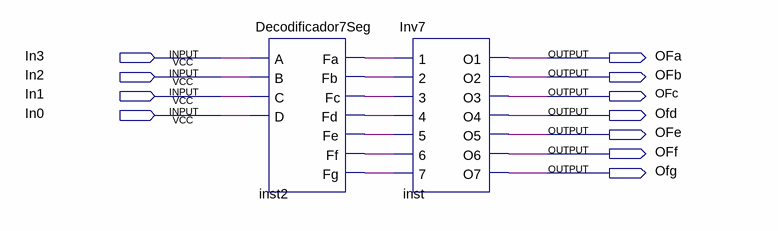
[diagram p0: schematic sheet]
// Quartus schematic Dec7Inv.bdf as structural Verilog: 2 symbols, 11 pins
module Dec7Inv (
  input  In3,
  input  In2,
  input  In1,
  input  In0,
  output OFa,
  output OFb,
  output OFc,
  output Ofd,
  output OFe,
  output OFf,
  output Ofg
);

  wire inst2_fa, inst2_fb, inst2_fc, inst2_fd, inst2_fe, inst2_ff, inst2_fg;

  Decodificador7Seg inst2 (
    .A(In3), .B(In2), .C(In1), .D(In0), .Fa(inst2_fa), .Fb(inst2_fb), .Fc(inst2_fc), .Fd(inst2_fd),
    .Fe(inst2_fe), .Ff(inst2_ff), .Fg(inst2_fg));
  Inv7 inst (
    .\1 (inst2_fa), .\2 (inst2_fb), .\3 (inst2_fc), .\4 (inst2_fd), .\5 (inst2_fe), .\6 (inst2_ff),
    .\7 (inst2_fg), .O1(OFa), .O2(OFb), .O3(OFc), .O4(Ofd), .O5(OFe), .O6(OFf), .O7(Ofg));
endmodule
